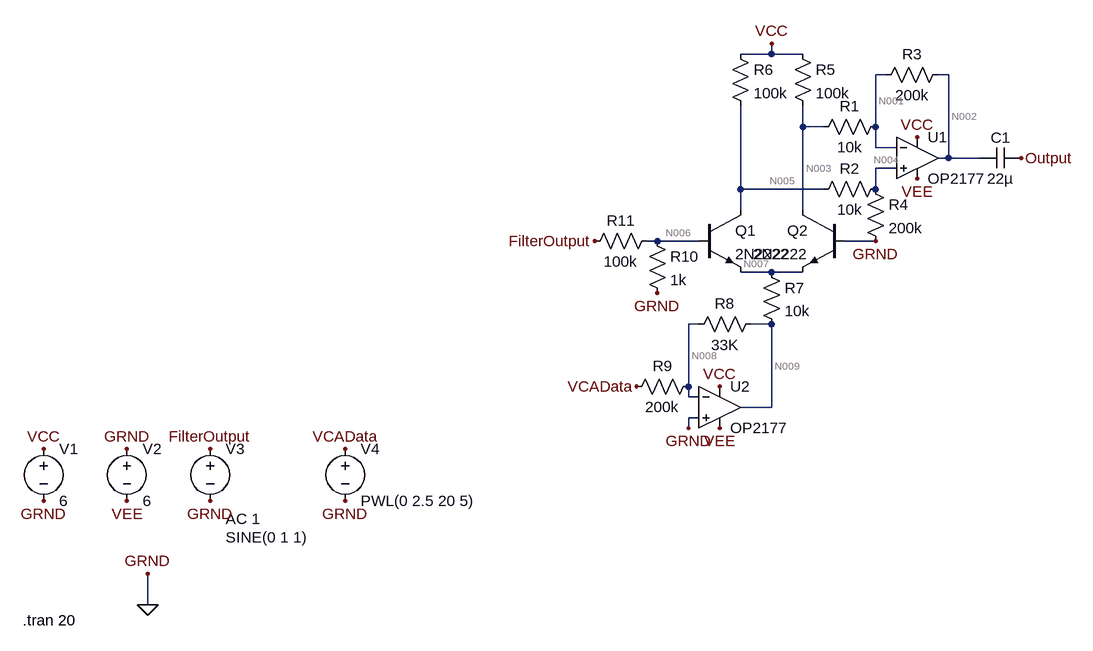
[diagram p0: schematic VCA.asc]
VCA.asc, the LTspice schematic file:
Version 4
SHEET 1 880 948
WIRE -64 16 -64 0
WIRE -64 16 -112 16
WIRE -16 16 -64 16
WIRE 112 48 96 48
WIRE 208 48 192 48
WIRE -16 128 -16 96
WIRE 16 128 -16 128
WIRE 96 128 96 48
WIRE 96 160 96 128
WIRE 128 160 96 160
WIRE 208 176 208 48
WIRE 208 176 192 176
WIRE 256 176 208 176
WIRE 128 192 96 192
WIRE -112 224 -112 96
WIRE 16 224 -112 224
WIRE 96 224 96 192
WIRE -112 256 -112 224
WIRE -16 256 -16 128
WIRE -240 304 -256 304
WIRE -176 304 -240 304
WIRE 96 304 48 304
WIRE -64 352 -112 352
WIRE -16 352 -64 352
WIRE -176 432 -192 432
WIRE -64 432 -96 432
WIRE -192 528 -192 432
WIRE -192 544 -192 528
WIRE -176 544 -192 544
WIRE -64 560 -64 432
WIRE -64 560 -112 560
WIRE -176 576 -192 576
WIRE -192 592 -192 576
WIRE -1024 864 -1024 816
FLAG -240 384 GRND
FLAG -192 592 GRND
FLAG 96 304 GRND
FLAG 160 144 VCC
FLAG -144 528 VCC
FLAG 160 208 VEE
FLAG -144 592 VEE
FLAG -64 0 VCC
FLAG -336 304 FilterOutput
FLAG -272 528 VCAData
FLAG 320 176 Output
FLAG -928 624 FilterOutput
FLAG -720 624 VCAData
FLAG -1184 624 VCC
FLAG -1056 704 VEE
FLAG -720 704 GRND
FLAG -928 704 GRND
FLAG -1056 624 GRND
FLAG -1184 704 GRND
FLAG -1024 864 0
FLAG -1024 816 GRND
SYMBOL OpAmps\\OP2177 160 112 R0
SYMATTR InstName U1
SYMBOL res 112 112 R90
WINDOW 0 0 56 VBottom 2
WINDOW 3 32 56 VTop 2
SYMATTR InstName R1
SYMATTR Value 10k
SYMBOL res 112 208 R90
WINDOW 0 0 56 VBottom 2
WINDOW 3 32 56 VTop 2
SYMATTR InstName R2
SYMATTR Value 10k
SYMBOL res 96 64 R270
WINDOW 0 32 56 VTop 2
WINDOW 3 0 56 VBottom 2
SYMATTR InstName R3
SYMATTR Value 200k
SYMBOL npn -176 256 R0
SYMATTR InstName Q1
SYMATTR Value 2N2222
SYMBOL npn 48 256 M0
SYMATTR InstName Q2
SYMATTR Value 2N2222
SYMBOL OpAmps\\OP2177 -144 496 R0
SYMATTR InstName U2
SYMBOL res 80 208 R0
SYMATTR InstName R4
SYMATTR Value 200k
SYMBOL res -32 0 R0
SYMATTR InstName R5
SYMATTR Value 100k
SYMBOL res -128 0 R0
SYMATTR InstName R6
SYMATTR Value 100k
SYMBOL res -80 336 R0
SYMATTR InstName R7
SYMATTR Value 10k
SYMBOL res -80 416 R90
WINDOW 0 0 56 VBottom 2
WINDOW 3 32 56 VTop 2
SYMATTR InstName R8
SYMATTR Value 33K
SYMBOL res -176 512 R90
WINDOW 0 0 56 VBottom 2
WINDOW 3 32 56 VTop 2
SYMATTR InstName R9
SYMATTR Value 200k
SYMBOL res -256 288 R0
SYMATTR InstName R10
SYMATTR Value 1k
SYMBOL res -240 288 R90
WINDOW 0 0 56 VBottom 2
WINDOW 3 32 56 VTop 2
SYMATTR InstName R11
SYMATTR Value 100k
SYMBOL cap 320 160 R90
WINDOW 0 0 32 VBottom 2
WINDOW 3 32 32 VTop 2
SYMATTR InstName C1
SYMATTR Value 22µ
SYMBOL voltage -1184 608 R0
WINDOW 123 0 0 Left 0
WINDOW 39 0 0 Left 0
SYMATTR InstName V1
SYMATTR Value 6
SYMBOL voltage -1056 608 R0
WINDOW 123 0 0 Left 0
WINDOW 39 0 0 Left 0
SYMATTR InstName V2
SYMATTR Value 6
SYMBOL voltage -928 608 R0
WINDOW 3 24 152 Left 2
WINDOW 123 24 124 Left 2
WINDOW 39 0 0 Left 0
SYMATTR Value SINE(0 1 1)
SYMATTR Value2 AC 1
SYMATTR InstName V3
SYMBOL voltage -720 608 R0
WINDOW 123 0 0 Left 0
WINDOW 39 0 0 Left 0
SYMATTR InstName V4
SYMATTR Value PWL(0 2.5 20 5)
TEXT -1216 888 Left 2 !.tran 20

The netlist it stands for:
* VCA.asc
XU1 N004 N001 VCC VEE N002 OP2177  ; pins In+ In- V+ V- OUT
R1 N001 N003 10k
R2 N004 N005 10k
R3 N001 N002 200k
Q1 N005 N006 N007 0 2N2222
Q2 N003 0 N007 0 2N2222
XU2 0 N008 VCC VEE N009 OP2177  ; pins In+ In- V+ V- OUT
R4 N004 0 200k
R5 VCC N003 100k
R6 VCC N005 100k
R7 N007 N009 10k
R8 N009 N008 33K
R9 N008 VCAData 200k
R10 N006 0 1k
R11 N006 FilterOutput 100k
C1 Output N002 22µ
V1 VCC 0 6
V2 0 VEE 6
V3 FilterOutput 0 SINE(0 1 1) AC 1
V4 VCAData 0 PWL(0 2.5 20 5)
.model NPN NPN
.model PNP PNP
.lib standard.bjt
.tran 20
.backanno
.end

* Results of the author's LTspice run, read from the files saved beside the schematic
* Operating Point, zero values left out:
*   V(n004) = 3.866 V
*   V(n001) = 3.866 V
*   V(vcc) = 6 V
*   V(vee) = -6 V
*   V(n002) = -25.22 µV
*   V(n003) = 4.059 V
*   V(n005) = 4.059 V
*   V(n006) = -388.4 nV
*   V(n007) = -410.9 mV
*   V(n008) = 3.125 µV
*   V(n009) = -412.5 mV
*   V(vcadata) = 2.5 V
*   Ic(Q1) = 82.41 nA
*   Ib(Q1) = 392.3 pA
*   Ie(Q1) = -82.8 nA
*   Ic(Q2) = 82.41 nA
*   Ib(Q2) = 392.3 pA
*   Ie(Q2) = -82.8 nA
*   I(R1) = -19.33 µA
*   I(R2) = -19.33 µA
*   I(R3) = 19.33 µA
*   I(R4) = 19.33 µA
*   I(R5) = 19.41 µA
*   I(R6) = 19.41 µA
*   I(R7) = 165.6 nA
*   I(R8) = -12.5 µA
*   I(R9) = -12.5 µA
*   I(R10) = -388.4 pA
*   I(R11) = -3.884 pA
*   I(V1) = -658.8 µA
*   I(V2) = -652 µA
*   I(V3) = -3.884 pA
*   I(V4) = -12.5 µA
*   Ix(u1:1) = -392.6 pA
*   Ix(u1:2) = -592.6 pA
*   Ix(u1:99) = 310 µA
*   Ix(u1:50) = -329.3 µA
*   Ix(u1:34) = 19.33 µA
*   Ix(u2:1) = -396.4 pA
*   Ix(u2:2) = -596.4 pA
*   Ix(u2:99) = 310 µA
*   Ix(u2:50) = -322.7 µA
*   Ix(u2:34) = 12.67 µA
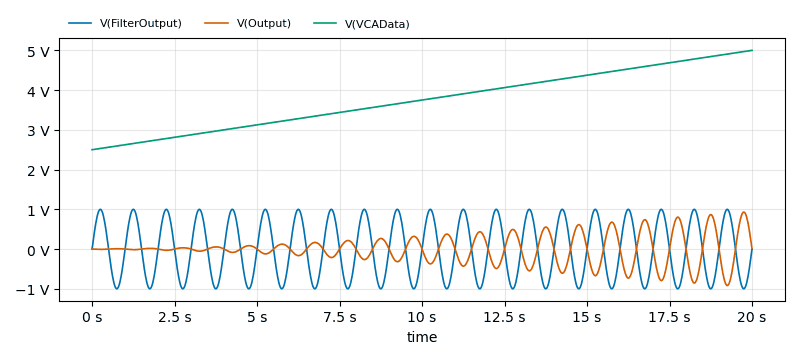
[diagram p1: Transient Analysis of VCA.asc, plotted from the saved traces]
* Transient Analysis, 1 run:
*   V(FilterOutput): min -1 V, max 1 V, average -136.8 nV, rms 707.1 mV, last 0 V
*   V(Output): min -918 mV, max 930.7 mV, average 3.547 mV, rms 345.4 mV, last 6.584 mV
*   V(VCAData): min 2.5 V, max 5 V, average 3.75 V, rms 3.819 V, last 5 V